# EasyEDA schematic LcsNodes-Building-Block-Power-Module-TLE5205.json
TITLE: Power Module TLE5205; REV: 1.0; Date: 2022-09-19; Sheet: 1/1; Drawn By: helmut-f; Company: Your Company
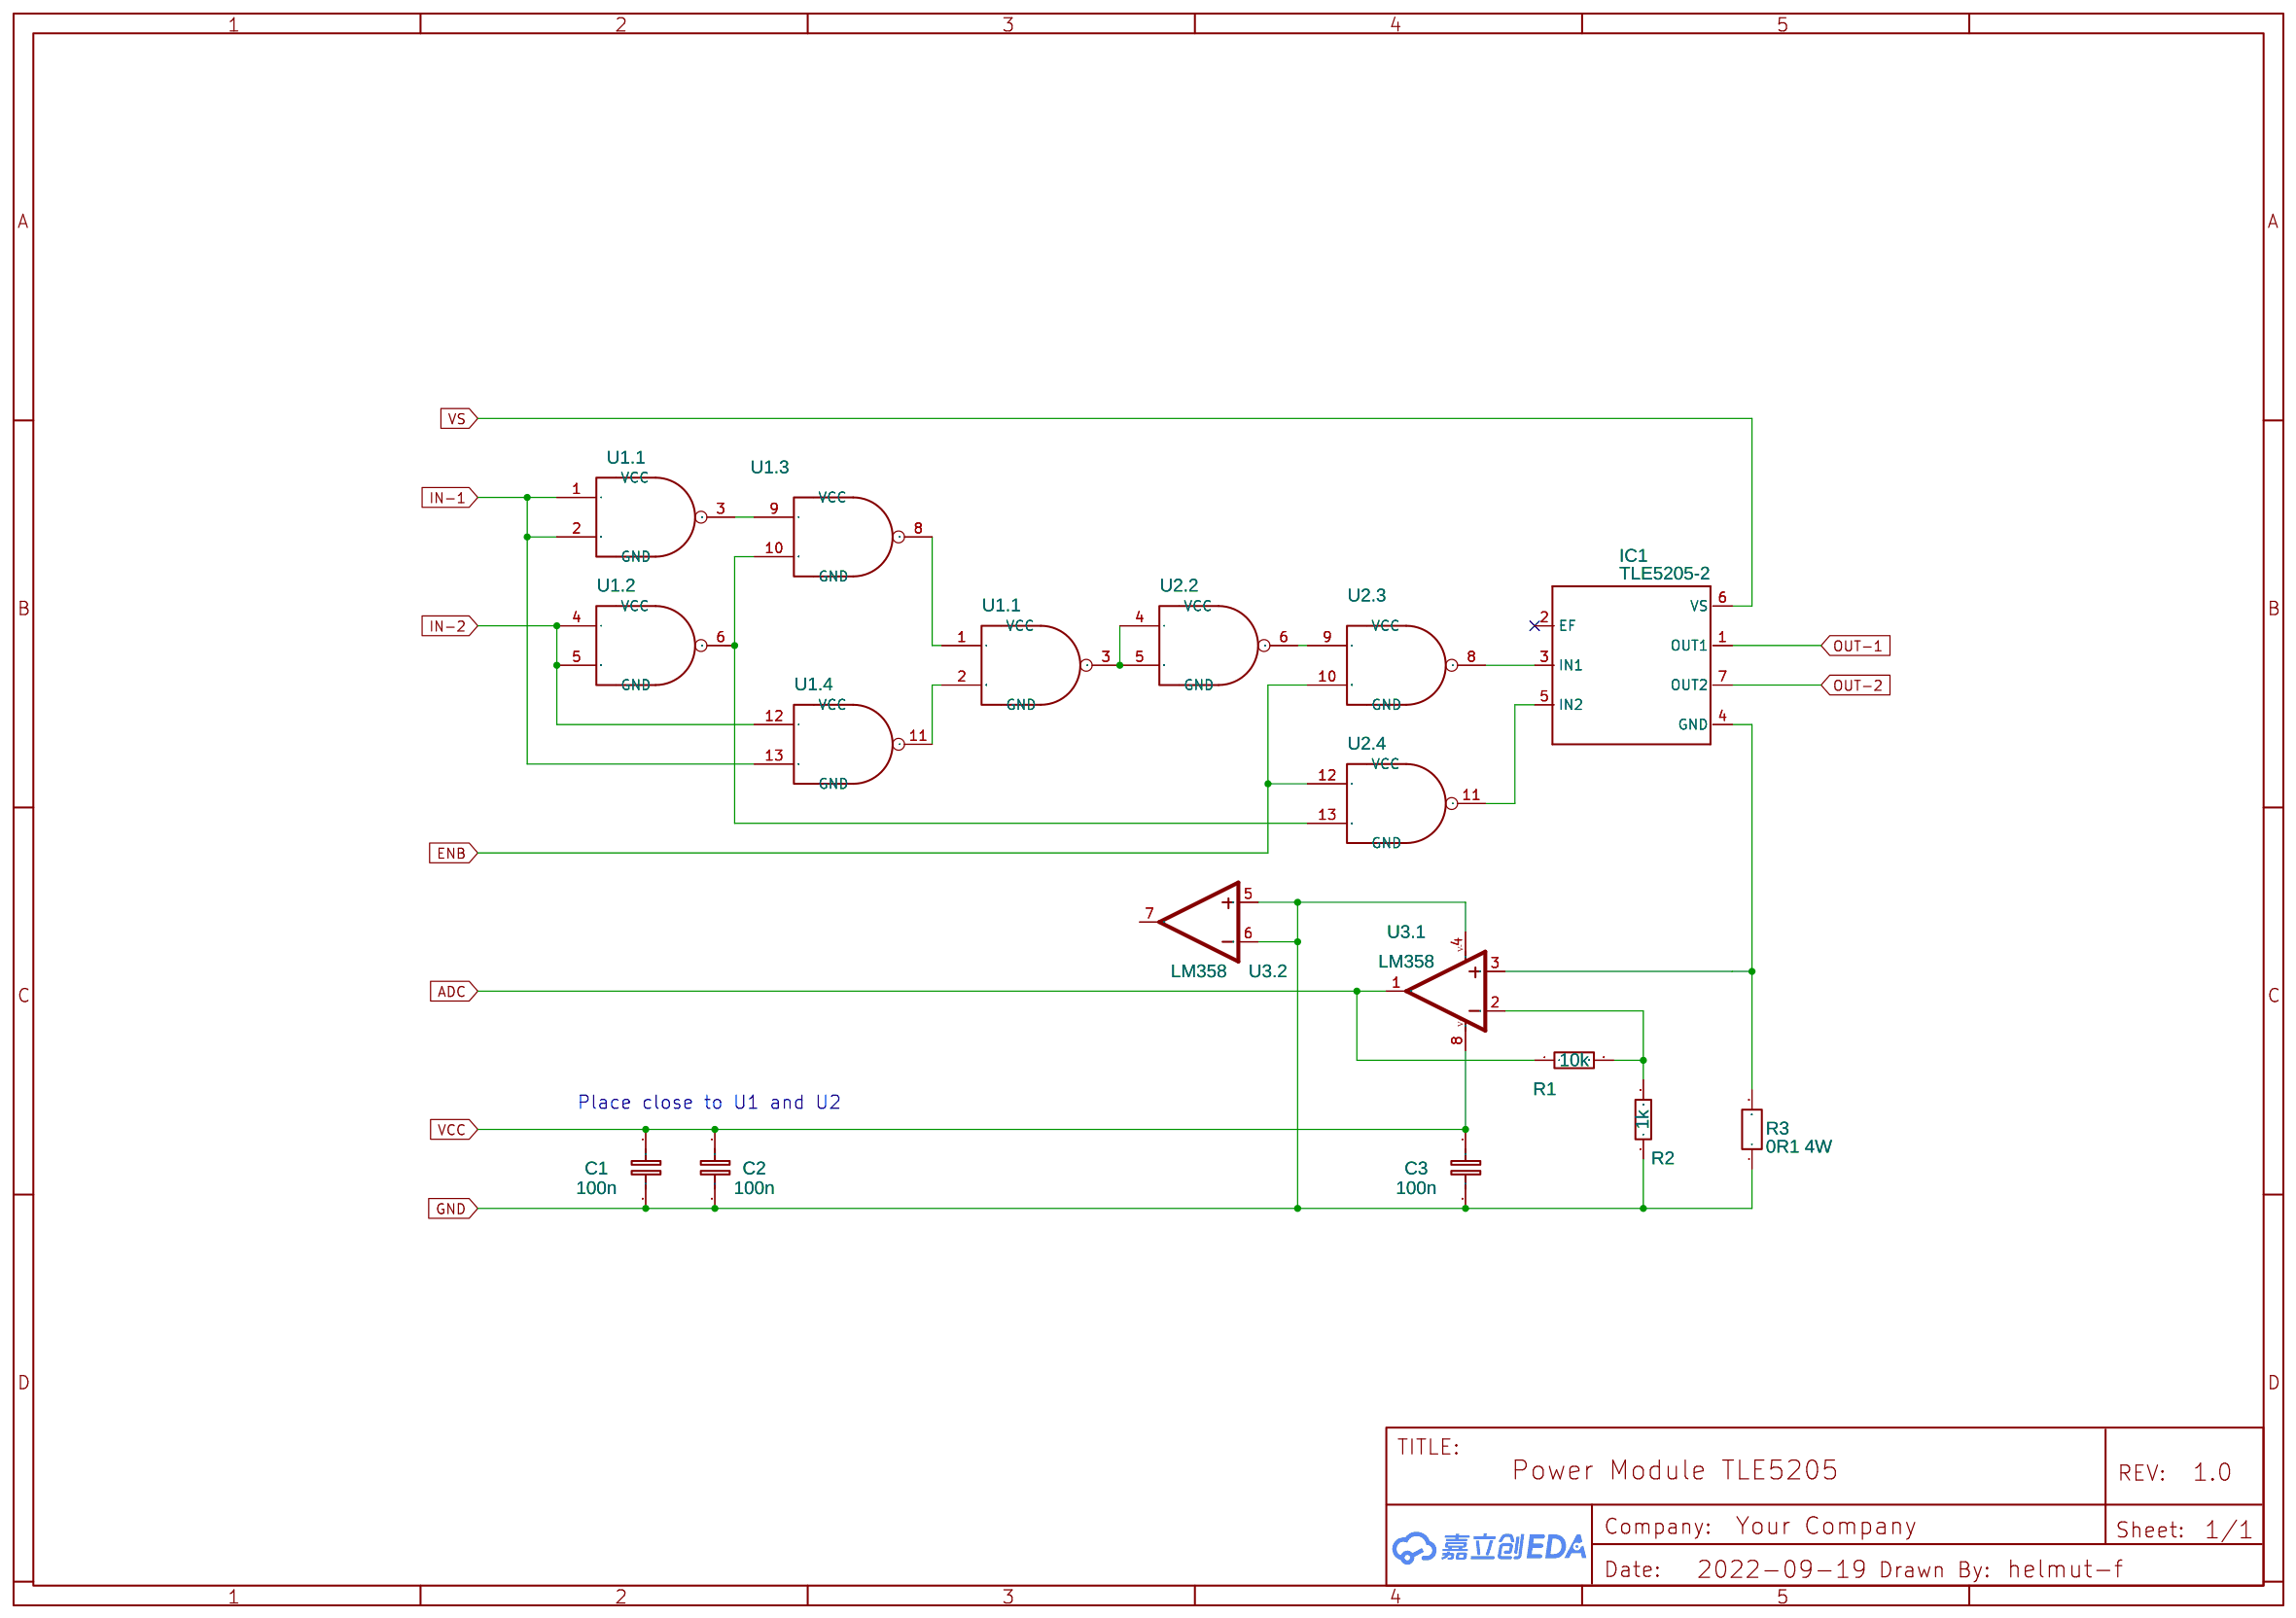
[diagram p0: schematic sheet]

## Parts
C1  100n  [RAD-0.2]
C2  100n  [RAD-0.2]
C3  100n  [RAD-0.2]
IC1  TLE5205-2  [P-TO220-7-11]
R1  10k  [AXIAL-0.1]
R2  1k  [AXIAL-0.1]
R3  0R1 4W  [R_AXIAL-0.8]
U1  74HC00  [DIP14]  (sections 1,2,3,4)
U1.1#2  74HC00  [DIP14]
U2  74HC00  [DIP14]  (sections 2,3,4)
U3  LM358  [DIP08-KIT]  (sections 1,2)

## Library data of the parts
C1-C3 = C_0603_EU: Contributor: LCEDA_Lib; Package Display: No
IC1 = TLE5205-2: Contributor: Madgrizzle Maslow
R1 R2 = RESISTOR-AXIAL-0.1
R3 = R_AXIAL-1.0_EU: Contributor: LCEDA_Lib; Package Display: No
U1 U1.1#2 U2 = 74HC00: Contributor: David EL; subpart_no: 1
U3 = LM358: Contributor: SparkFun; subpart_no: 1

## Nets
GND: C1.2 C2.2 C3.2 R2.1 R3.1 U3.4(V-) U3.5(+IN) U3.6(-IN)
VCC: C1.1 C2.1 C3.1 U3.8(V+)
ADC: R1.1 U3.1(OUT)
ENB: U2.10(B) U2.12(A)
IN-1: U1.1(A) U1.2(B) U1.13(B)
IN-2: U1.4(A) U1.5(B) U1.12(A)
OUT-1: IC1.1(OUT1)
OUT-2: IC1.7(OUT2)
VS: IC1.6(VS)
Net-(IC1-3): IC1.3(IN1) U2.8(Y)
Net-(IC1-4): IC1.4(GND) R3.2 U3.3(+IN)
Net-(IC1-5): IC1.5(IN2) U2.11(Y)
Net-(R1-2): R1.2 R2.2 U3.2(-IN)
Net-(U1.1#2-1): U1.8(Y) U1.1#2.1(A)
Net-(U1.1#2-2): U1.11(Y) U1.1#2.2(B)
Net-(U1.1#2-3): U1.1#2.3(Y) U2.4(A) U2.5(B)
Net-(U1.1-3): U1.3(Y) U1.9(A)
Net-(U1.2-6): U1.6(Y) U1.10(B) U2.13(B)
Net-(U2.2-6): U2.6(Y) U2.9(A)

Not connected (* = marked no-connect by the designer): IC1 2(EF)*; U1 7(GND) 14(VCC); U1.1#2 7(GND) 14(VCC); U2 7(GND) 14(VCC); U3 7(OUT)

## Notes on the sheet
- Place close to U1 and U2
